# Altium schematic sheet Sensors&Actuators.SchDoc
size A; SheetNumber: 2; SheetTotal: 2
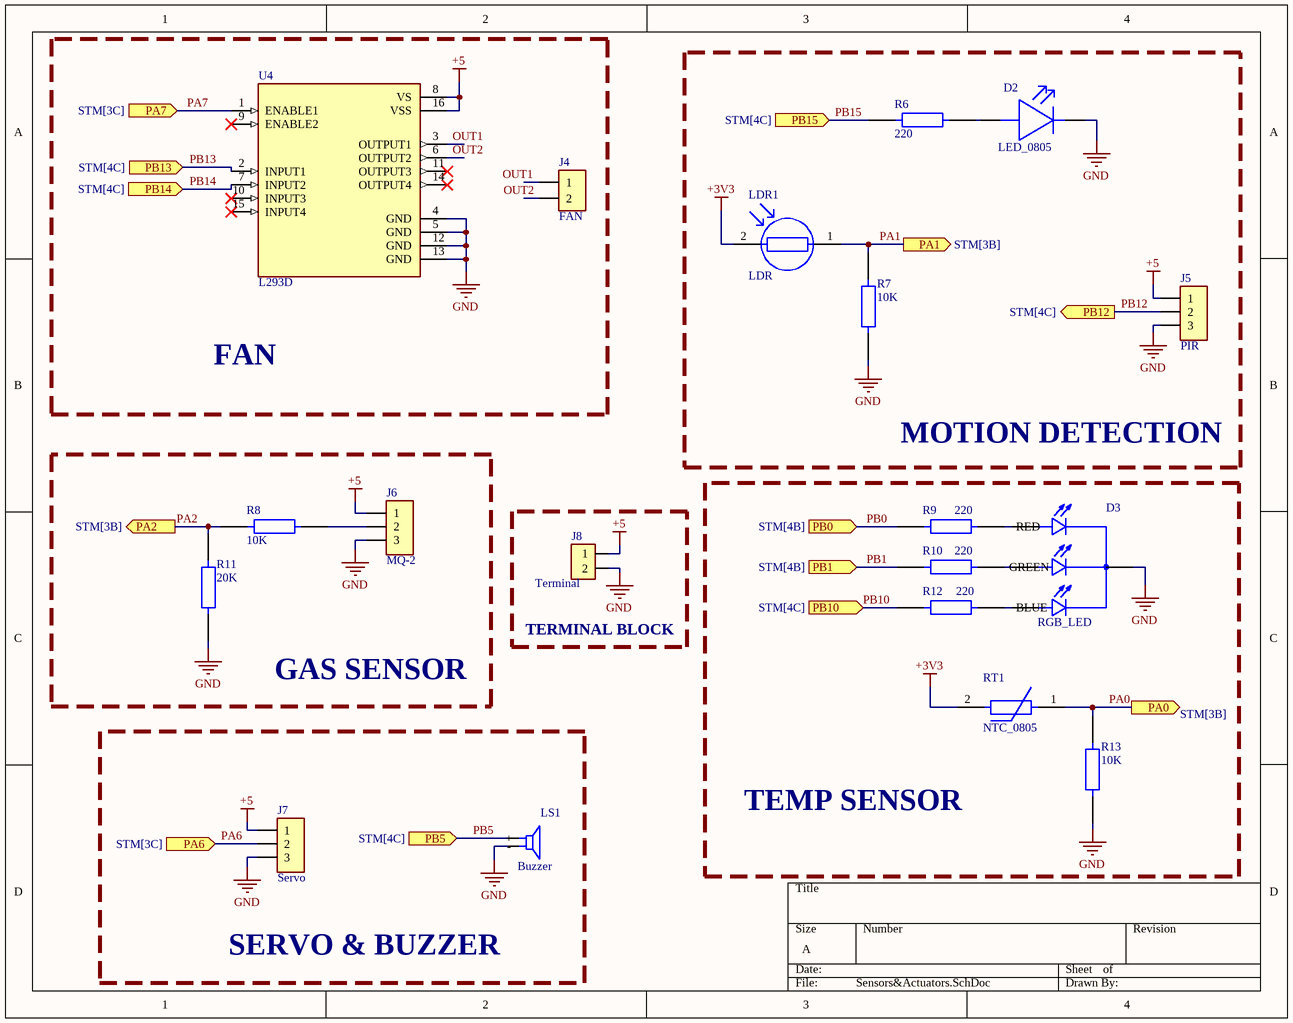
[diagram p0: Sensors&Actuators.SchDoc]

## Parts
D2  LED_0805  [LED_0805]
D3  RGB_LED  [RGB_LED]
J4  FAN  [pin_header_2]
J5  PIR  [pin_header_3]
J6  MQ-2  [pin_header_3]
J7  Servo  [pin_header_3]
J8  Terminal  [Terminal]
LDR1  LDR  [LDR]
LS1  Buzzer  [Buzzer]
R6  220  [RES_0805]
R7  10K  [RES_0805]
R8  10K  [RES_0805]
R9  220  [RES_0805]
R10  220  [RES_0805]
R11  20K  [RES_0805]
R12  220  [RES_0805]
R13  10K  [RES_0805]
RT1  NTC_0805  [NTC_0805]
U4  L293D  [L293D]

## Blocks framed on the sheet
FAN: J4 U4
MOTION DETECTION: D2 J5 LDR1 R6 R7
GAS SENSOR: J6 R8 R11
TEMP SENSOR: D3 R9 R10 R12 R13 RT1
TERMINAL BLOCK: J8
SERVO & BUZZER: J7 LS1

## Ports
PA0 (out, see STM[3B]), PA1 (out, see STM[3B]), PA2 (out, see STM[3B]), PA6 (in, see STM[3C]), PA7 (in, see STM[3C]), PB0 (in, see STM[4B]), PB1 (in, see STM[4B]), PB5 (in, see STM[4C]), PB10 (in, see STM[4C]), PB12 (out, see STM[4C]), PB13 (in, see STM[4C]), PB14 (in, see STM[4C]), PB15 (in, see STM[4C])

## Nets
+3V3: LDR1.2 RT1.2
+5: J5.1 J6.1 J7.1 J8.1 U4.8(VS) U4.16(VSS)
GND: D2.2 D3.1(GND) J5.3 J6.3 J7.3 J8.2 LS1.2(-) R7.2 R11.2 R13.2 U4.4(GND) U4.5(GND) U4.12(GND) U4.13(GND)
OUT1: J4.1 U4.3(OUTPUT1)
OUT2: J4.2 U4.6(OUTPUT2)
PA0: R13.1 RT1.1 ; port PA0
PA1: LDR1.1 R7.1 ; port PA1
PA2: R8.2 R11.1 ; port PA2
PA6: J7.2 ; port PA6
PA7: U4.1(ENABLE1) ; port PA7
PB0: R9.2 ; port PB0
PB1: R10.2 ; port PB1
PB5: LS1.1(+) ; port PB5
PB10: R12.2 ; port PB10
PB12: J5.2 ; port PB12
PB13: U4.2(INPUT1) ; port PB13
PB14: U4.7(INPUT2) ; port PB14
PB15: R6.2 ; port PB15
NetD2_1: D2.1 R6.1
NetD3_2: D3.2(RED) R9.1
NetD3_3: D3.3(GREEN) R10.1
NetD3_4: D3.4(BLUE) R12.1
NetJ6_2: J6.2 R8.1

Not connected (* = marked no-connect by the designer): U4 9(ENABLE2)* 10(INPUT3)* 11(OUTPUT3)* 14(OUTPUT4)* 15(INPUT4)*

## Library data of the parts
D2 = LED_0805: LED RED 0805 SMD; MFR: YONGYUTAI; MFR PART#: YLED0805R; Supplier: LCSC; Supplier PART#: C19171391; ComponentLink1Description: Data Sheet; ComponentLink1URL: https://www.lcsc.com/datasheet/C19171391.pdf?spm=wm.sxq.inf.ggs___wm.fly.bg.0.xh&lcsc_vid=RAIMXwZeRgRXUFAAT1RZBAEFEVIIVgdSQFlfUgUDFQcxVlNeQVRaUlRVRlZcXjsOAxUeFF5JWBYZEEoKFBINSQcJGk4NBhADEA4cHktXRlhXSQwSGg0%3D
D3 = RGB_LED: TriColor ChipLED; MFR: Broadcom; MFR PART#: HSMF-C118; Supplier: LCSC; Supplier PART#: C6795867; ComponentLink1Description: Data Sheet; ComponentLink1URL: https://www.lcsc.com/datasheet/C6795867.pdf?spm=wm.sxq.inf.ggs___wm.fly.bg.1.xh&lcsc_vid=FgVdAVJeFgAKAVAAT1ldBVYDR1ZcX11XR1lZVl1WEQMxVlNeT1dcXlZURlZaVjsOAxUeFF5JWBYZEEoKFBINSQcJGk4NBhADEA4cHktSRlFADxALGw%3D%3D
J4 = pin_header_2: 1kV 1 2.54mm Pin Header 3A 2.5mm Through Hole 6mm 3P -40℃~+105℃ 3mm Gold 1x2P Through Hole,P=2.54mm Headers, Male Pins; MFR: hanxia; MFR PART#: HX PH254-01-03-Z-L11.5 pcb pin header; Supplier: LCSC; Supplier PART#: C52016391; ComponentLink1Description: Data Sheet; ComponentLink1URL: https://www.lcsc.com/datasheet/C52016391.pdf?spm=wm.sxq.inf.ggs___wm.fly.bg.1.xh&lcsc_vid=RAIMXwZeRgRXUFAAT1RZBAEFEVIIVgdSQFlfUgUDFQcxVlNeQFJcUFdRQlZdUDsOAxUeFF5JWBYZEEoKFBINSQcJGk4NBhADEA4cHktXT1BADxALGw%3D%3D
J5-J7 = pin_header_3: 1kV 1 2.54mm Pin Header 3A 2.5mm Through Hole 6mm 3P -40℃~+105℃ 3mm Gold 1x3P Through Hole,P=2.54mm Headers, Male Pins; MFR: hanxia; MFR PART#: HX PH254-01-03-Z-L11.5 pcb pin header; Supplier: LCSC; Supplier PART#: C52016391; ComponentLink1Description: Data Sheet; ComponentLink1URL: https://www.lcsc.com/datasheet/C52016391.pdf?spm=wm.sxq.inf.ggs___wm.fly.bg.1.xh&lcsc_vid=RAIMXwZeRgRXUFAAT1RZBAEFEVIIVgdSQFlfUgUDFQcxVlNeQFJcUFdRQlZdUDsOAxUeFF5JWBYZEEoKFBINSQcJGk4NBhADEA4cHktXT1BADxALGw%3D%3D
J8 = Terminal: TERM BLK 2POS 5.08mm TH; MFR: KANGNEX; MFR PART#: WJ500V-5.08-2P; Supplier: LCSC; Supplier PART#: C8465; ComponentLink1Description: Data Sheet; ComponentLink1URL: https://www.lcsc.com/datasheet/C8465.pdf?spm=wm.sxq.inf.ggs___wm.fly.bg.1.xh&lcsc_vid=RAIMXwZeRgRXUFAAT1RZBAEFEVIIVgdSQFlfUgUDFQcxVlNeQVRaUFdVR1VbVTsOAxUeFF5JWBYZEEoKFBINSQcJGk4dAgUUFAk%3D
LDR1 = LDR: Photoconductive Cell; MFR: JCHL; MFR PART#: GT36516; Supplier: LCSC; Supplier PART#: C2904880; ComponentLink1Description: Data Sheet; ComponentLink1URL: https://www.lcsc.com/datasheet/C2904880.pdf?spm=wm.sxq.inf.ggs___wm.fly.bg.2.xh&lcsc_vid=FgVdAVJeFgAKAVAAT1ldBVYDR1ZcX11XR1lZVl1WEQMxVlNeT1JZUVBXRVZXUTsOAxUeFF5JWBYZEEoKFBINSQcJGk4dAgUUFAk%3D
LS1 = Buzzer: Active Buzzer (Built-in Driving Circuit) 2.3kHz 5V Electromagnetic Alarms, Buzzers, and Sirens; MFR: CUI; MFR PART#: CMI-1295-0585T; Supplier: LCSC; Supplier PART#: C22359712; ComponentLink1Description: Data Sheet; ComponentLink1URL: https://www.lcsc.com/datasheet/C22359712.pdf?spm=wm.sxq.inf.ggs___wm.fly.bg.0.xh&lcsc_vid=FgVdAVJeFgAKAVAAT1ldBVYDR1ZcX11XR1lZVl1WEQMxVlNeT1dcVFdfRVdcVzsOAxUeFF5JWBYZEEoKFBINSQcJGk4NBhADEA4cHktTRk8GEwkK
R6 R9 R10 R12 = RES_0805_220: RES 220Ω ±0.1% 125mW 0805; MFR: YAGEO; MFR PART#: RT0805BRD07220RL; Supplier: LCSC; Supplier PART#: C865304; ComponentLink1Description: Data Sheet; ComponentLink1URL: https://www.lcsc.com/datasheet/C865304.pdf?spm=wm.sxq.inf.ggs___wm.fly.bg.8.xh&lcsc_vid=RAIMXwZeRgRXUFAAT1RZBAEFEVIIVgdSQFlfUgUDFQcxVlNeQFJfUlFQQ1NaVzsOAxUeFF5JWBYZEEoKFBINSQcJGk4NBhADEA4cHktfQ1hADxALGw%3D%3D
R7 R8 R13 = RES_0805_10K: RES 10kΩ ±0.1% 125mW 0805; MFR: YAGEO; MFR PART#: RT0805BRD0710KL; Supplier: LCSC; Supplier PART#: C110775; ComponentLink1Description: Data Sheet; ComponentLink1URL: https://www.lcsc.com/datasheet/C95781.pdf?spm=wm.sxq.inf.ggs___wm.fly.bg.2.xh&lcsc_vid=RAIMXwZeRgRXUFAAT1RZBAEFEVIIVgdSQFlfUgUDFQcxVlNeQVRaVlNURlFeXzsOAxUeFF5JWBYZEEoKFBINSQcJGk4eFQsCAgIaSgADAwAHC0sFHwgeShYDBAgdEwsUWhIbFQIHFARDCgsTGRUxEQtLR1leUklTWlAFOCdUT1lXUlZVWQkaCgg%3D
R11 = RES_0805_20K: RES 20kΩ ±1% 125mW 0805; MFR: YAGEO; MFR PART#: RC0805FR-0720KL; Supplier: LCSC; Supplier PART#: C114566; ComponentLink1Description: Data Sheet; ComponentLink1URL: https://www.lcsc.com/datasheet/C114566.pdf?spm=wm.sxq.inf.ggs___wm.fly.bg.2.xh&lcsc_vid=FgVdAVJeFgAKAVAAT1ldBVYDR1ZcX11XR1lZVl1WEQMxVlNeT1dXUlJURFJfUjsOAxUeFF5JWBYZEEoKFBINSQcJGk4dAgUUFAk%3D
RT1 = NTC_0805: THERMISTOR NTC 10kΩ 0805; MFR: VISHAY; MFR PART#: NTCS0805E3103JHT; Supplier: LCSC; Supplier PART#: C511025; ComponentLink1Description: Data Sheet; ComponentLink1URL: https://www.lcsc.com/datasheet/C511025.pdf?spm=wm.sxq.inf.ggs___wm.fly.bg.9.xh&lcsc_vid=FgVdAVJeFgAKAVAAT1ldBVYDR1ZcX11XR1lZVl1WEQMxVlNeT1JZVVFeRldaXzsOAxUeFF5JWBYZEEoKFBINSQcJGk4NBhADEA4cHktXRVZcSQwSGg0%3D
U4 = L293D: PUSH-PULL FOUR CHANNEL DRIVER WITH DIODES; MFR: ST; MFR PART#: L293D; Supplier: LCSC; Supplier PART#: C12340; ComponentLink1Description: Data Sheet; ComponentLink1URL: https://www.lcsc.com/datasheet/C12340.pdf?spm=wm.sxq.inf.ggs___wm.ssy.bg.0.xh&lcsc_vid=FgVdAVJeFgAKAVAAT1ldBVYDR1ZcX11XR1lZVl1WEQMxVlNeT1dcUlJXR1hbUjsOAxUeFF5JWBYZEEoKFBINSQcJGk4dAgUUFAk%3D